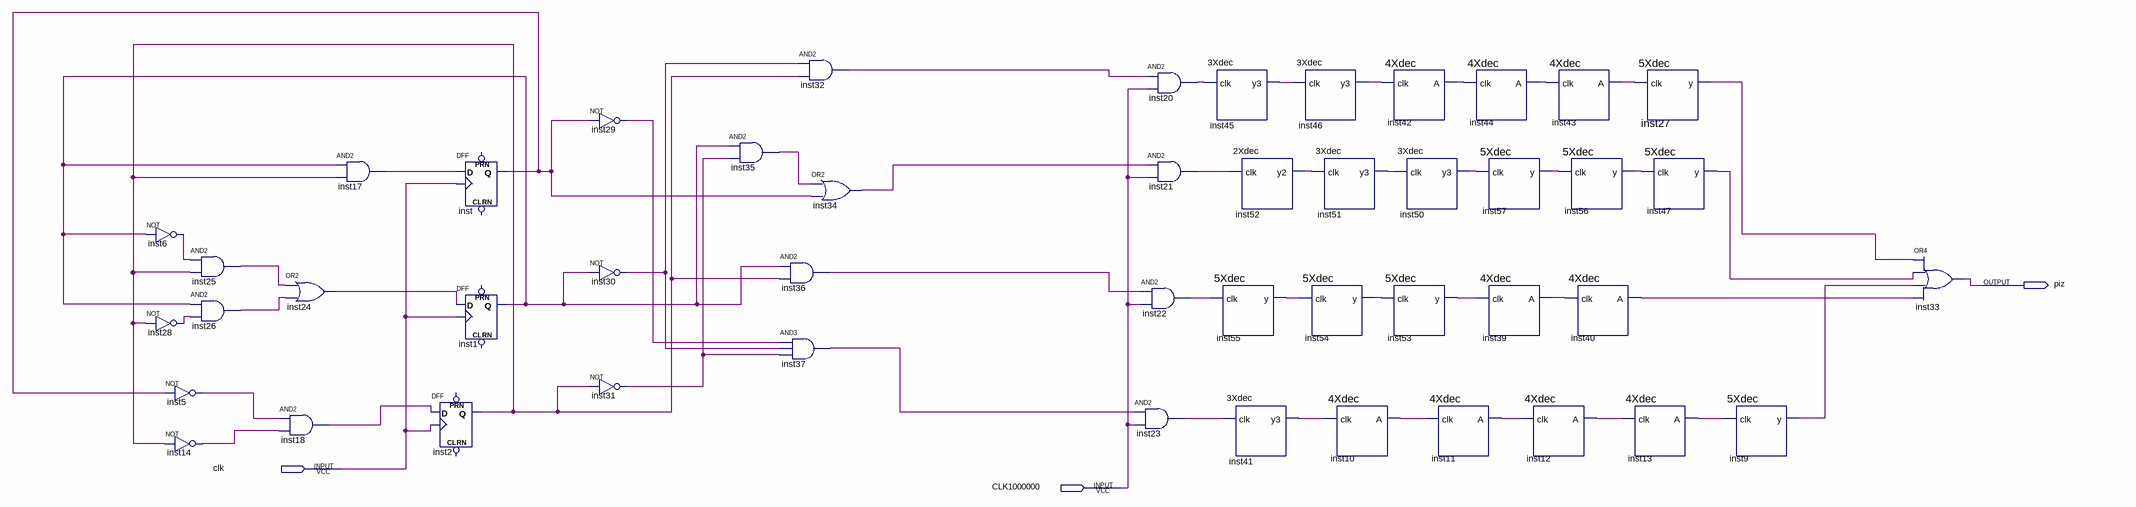
[diagram p0: schematic sheet]
// Quartus schematic FPGA2-3.bdf as structural Verilog: 48 symbols, 3 pins
module \FPGA2-3  (
  input  clk,
  input  CLK1000000,
  output piz
);

  wire inst1_q, inst2_q, inst5_out, inst6_out, inst9_y, inst10_a, inst11_a, inst12_a, inst13_a, inst14_out,
       inst17_out, inst18_out, inst20_out, inst21_out, inst22_out, inst23_out, inst24_out, inst25_out,
       inst26_out, inst27_y, inst28_out, inst29_out, inst30_out, inst31_out, inst32_out, inst34_out,
       inst35_out, inst36_out, inst37_out, inst39_a, inst40_a, inst41_y3, inst42_a, inst43_a, inst44_a,
       inst45_y3, inst46_y3, inst47_y, inst50_y3, inst51_y3, inst52_y2, inst53_y, inst54_y, inst55_y,
       inst56_y, inst57_y, inst_q;

  not inst6 (inst6_out, inst1_q);
  not inst28 (inst28_out, inst2_q);
  not inst5 (inst5_out, inst_q);
  not inst14 (inst14_out, inst2_q);
  and inst25 (inst25_out, inst6_out, inst2_q);
  and inst26 (inst26_out, inst1_q, inst28_out);
  or inst24 (inst24_out, inst25_out, inst26_out);
  and inst18 (inst18_out, inst5_out, inst14_out);
  and inst17 (inst17_out, inst1_q, inst2_q);
  DFF inst (.CLK(clk), .D(inst17_out), .Q(inst_q));  // open: CLRN, PRN
  DFF inst1 (.CLK(clk), .D(inst24_out), .Q(inst1_q));  // open: CLRN, PRN
  DFF inst2 (.CLK(clk), .D(inst18_out), .Q(inst2_q));  // open: CLRN, PRN
  not inst29 (inst29_out, inst_q);
  not inst30 (inst30_out, inst1_q);
  not inst31 (inst31_out, inst2_q);
  and inst35 (inst35_out, inst1_q, inst31_out);
  and inst32 (inst32_out, inst30_out, inst2_q);
  or inst34 (inst34_out, inst35_out, inst_q);
  and inst36 (inst36_out, inst1_q, inst2_q);
  and inst37 (inst37_out, inst29_out, inst30_out, inst31_out);
  and inst20 (inst20_out, inst32_out, CLK1000000);
  and inst21 (inst21_out, inst34_out, CLK1000000);
  and inst22 (inst22_out, inst36_out, CLK1000000);
  and inst23 (inst23_out, inst37_out, CLK1000000);
  \3Xdec  inst45 (.clk(inst20_out), .y3(inst45_y3));
  \2Xdec  inst52 (.clk(inst21_out), .y2(inst52_y2));
  \5Xdec  inst55 (.clk(inst22_out), .y(inst55_y));
  \3Xdec  inst41 (.clk(inst23_out), .y3(inst41_y3));
  \3Xdec  inst46 (.clk(inst45_y3), .y3(inst46_y3));
  \3Xdec  inst51 (.clk(inst52_y2), .y3(inst51_y3));
  \5Xdec  inst54 (.clk(inst55_y), .y(inst54_y));
  \4Xdec  inst10 (.clk(inst41_y3), .A(inst10_a));
  \4Xdec  inst42 (.clk(inst46_y3), .A(inst42_a));
  \5Xdec  inst53 (.clk(inst54_y), .y(inst53_y));
  \3Xdec  inst50 (.clk(inst51_y3), .y3(inst50_y3));
  \4Xdec  inst11 (.clk(inst10_a), .A(inst11_a));
  \4Xdec  inst44 (.clk(inst42_a), .A(inst44_a));
  \5Xdec  inst57 (.clk(inst50_y3), .y(inst57_y));
  \4Xdec  inst39 (.clk(inst53_y), .A(inst39_a));
  \4Xdec  inst12 (.clk(inst11_a), .A(inst12_a));
  \4Xdec  inst43 (.clk(inst44_a), .A(inst43_a));
  \5Xdec  inst56 (.clk(inst57_y), .y(inst56_y));
  \4Xdec  inst40 (.clk(inst39_a), .A(inst40_a));
  \5Xdec  inst27 (.clk(inst43_a), .y(inst27_y));
  \4Xdec  inst13 (.clk(inst12_a), .A(inst13_a));
  \5Xdec  inst47 (.clk(inst56_y), .y(inst47_y));
  \5Xdec  inst9 (.clk(inst13_a), .y(inst9_y));
  or inst33 (piz, inst27_y, inst47_y, inst9_y, inst40_a);
endmodule
